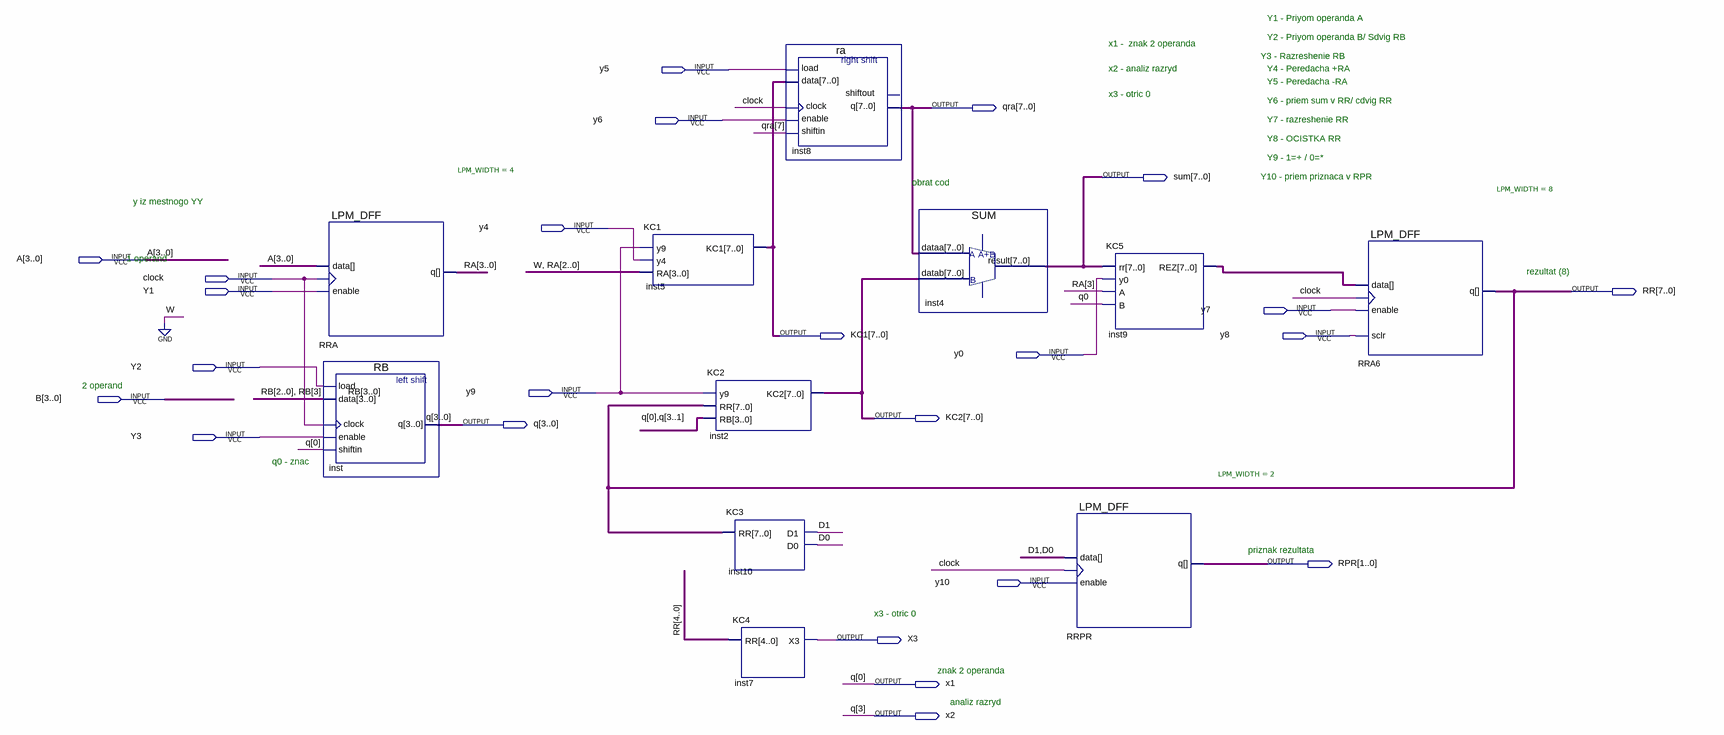
[diagram p0: schematic sheet]
// Quartus schematic BO.bdf as structural Verilog: 11 symbols, 24 pins
module BO (
  input  y5,
  input  y6,
  input  y4,
  input  [3:0] A,
  input  clock,
  input  Y1,
  input  y7,
  input  y8,
  input  y0,
  input  Y2,
  input  y9,
  input  [3:0] B,
  input  Y3,
  input  y10,
  output [7:0] qra,
  output [7:0] sum,
  output [7:0] RR,
  output [7:0] KC1,
  output [7:0] KC2,
  output [3:0] q,
  output [1:0] RPR,
  output X3,
  output x1,
  output x2
);

  wire D0, D1;
  wire [3:0] RA;
  wire [7:0] inst9_rez;

  LPM_DFF #(.LPM_WIDTH(4)) RRA (.clock(clock), .data(A), .enable(Y1), .q(RA));
  RB inst (.clock(clock), .data({B[2:0], B[3]}), .enable(Y3), .load(Y2), .shiftin(q[0]), .q(q));
  KC1 inst5 (.y9(y9), .y4(y4), .RA({1'b0, RA[2:0]}), .KC1(KC1));
  KC2 inst2 (.y9(y9), .RR(RR), .RB({q[0], q[3:1]}), .KC2(KC2));
  KC3 inst10 (.RR(RR), .D1(D1), .D0(D0));
  KC4 inst7 (.RR(RR[4:0]), .X3(X3));
  ra inst8 (.load(y5), .data(KC1), .clock(clock), .enable(y6), .shiftin(qra[7]), .q(qra));  // open: shiftout
  SUM inst4 (.dataa(qra), .datab(KC2), .result(sum));
  LPM_DFF #(.LPM_WIDTH(2)) RRPR (.clock(clock), .data({D1, D0}), .enable(y10), .q(RPR));
  KC5 inst9 (.rr(sum), .y0(y0), .A(RA[3]), .B(q[0]), .REZ(inst9_rez));
  LPM_DFF #(.LPM_WIDTH(8)) RRA6 (.clock(clock), .data(inst9_rez), .enable(y7), .sclr(y8), .q(RR));

  assign x1 = q[0];
  assign x2 = q[3];

  // Other names for the same wires on the sheet: RB[3:0] = B

  // Notes on the sheet:
  //   Y1 - Priyom operanda A
  //   Y2 - Priyom operanda B/ Sdvig RB
  //   x1 -  znak 2 operanda 
  //   Y3 - Razreshenie RB
  //   x2 - analiz razryd
  //   Y4 - Peredacha +RA
  //   Y5 - Peredacha -RA
  //   x3 - otric 0
  //   Y6 - priem sum v RR/ cdvig RR
  //   Y7 - razreshenie RR
  //   Y8 - OCISTKA RR
  //   Y9 - 1=+ / 0=*
  //   Y10 - priem priznaca v RPR
  //   obrat cod
  //   y iz mestnogo YY
  //   1 operand
  //   rezultat (8)
  //   2 operand
  //   q0 - znac
  //   priznak rezultata
  //   x3 - otric 0
  //   znak 2 operanda
  //   analiz razryd
endmodule
